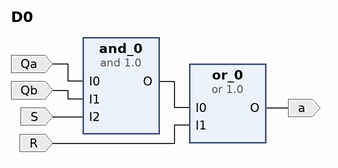
[diagram p0: block diagram of the top level]
# Vivado block design D0, xc7a35tcpg236-1, Vivado 2018.3
create_bd_design D0

create_bd_port -dir I -type data Qa
create_bd_port -dir I -type data Qb
create_bd_port -dir I -type data S
create_bd_port -dir I -type data R
create_bd_port -dir O -type data a

create_bd_cell -type ip -vlnv FIT:user:or:1.0 or_0
create_bd_cell -type ip -vlnv FIT:user:and:1.0 and_0
set_property -dict {CONFIG.I1_inverted true CONFIG.I2_inverted true CONFIG.Inputs 3} [get_bd_cells and_0]

# ---- connections ----

connect_bd_net -net I0_0_1 [get_bd_ports Qa] [get_bd_pins and_0/I0]
connect_bd_net -net I1_0_1 [get_bd_ports Qb] [get_bd_pins and_0/I1]
connect_bd_net -net I2_0_1 [get_bd_ports S] [get_bd_pins and_0/I2]
connect_bd_net [get_bd_pins and_0/O] [get_bd_pins or_0/I0]
connect_bd_net -net I1_0_2 [get_bd_ports R] [get_bd_pins or_0/I1]
connect_bd_net [get_bd_pins or_0/O] [get_bd_ports a]

validate_bd_design
save_bd_design
